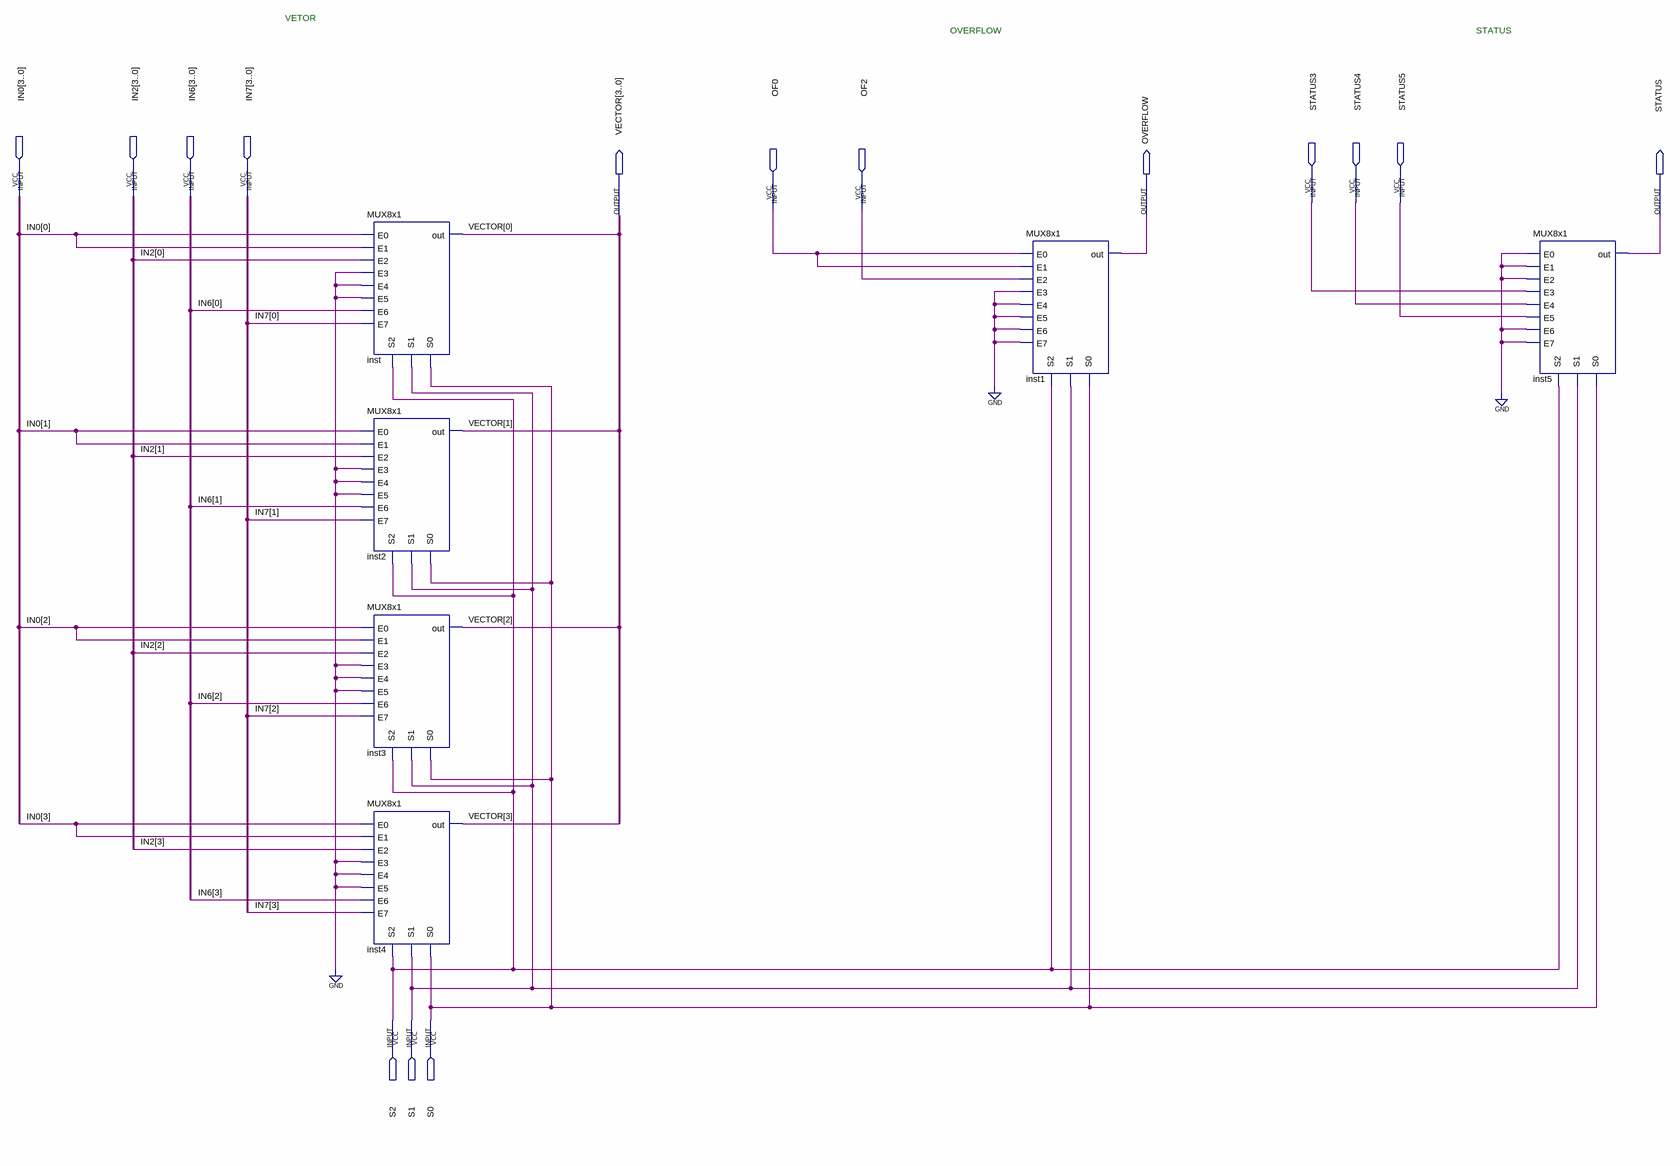
[diagram p0: schematic sheet]
// Quartus schematic MUX8x1Correct.bdf as structural Verilog: 6 symbols, 15 pins
module MUX8x1Correct (
  input  [3:0] IN0,
  input  [3:0] IN2,
  input  [3:0] IN6,
  input  [3:0] IN7,
  input  STATUS3,
  input  STATUS4,
  input  STATUS5,
  input  OF0,
  input  OF2,
  input  S2,
  input  S1,
  input  S0,
  output [3:0] VECTOR,
  output OVERFLOW,
  output STATUS
);

  MUX8x1 inst (
    .E0(IN0[0]), .E1(IN0[0]), .E2(IN2[0]), .E3(1'b0), .E4(1'b0), .E5(1'b0), .E6(IN6[0]), .E7(IN7[0]),
    .S0(S0), .S1(S1), .S2(S2), .out(VECTOR[0]));
  MUX8x1 inst2 (
    .E0(IN0[1]), .E1(IN0[1]), .E2(IN2[1]), .E3(1'b0), .E4(1'b0), .E5(1'b0), .E6(IN6[1]), .E7(IN7[1]),
    .S0(S0), .S1(S1), .S2(S2), .out(VECTOR[1]));
  MUX8x1 inst3 (
    .E0(IN0[2]), .E1(IN0[2]), .E2(IN2[2]), .E3(1'b0), .E4(1'b0), .E5(1'b0), .E6(IN6[2]), .E7(IN7[2]),
    .S0(S0), .S1(S1), .S2(S2), .out(VECTOR[2]));
  MUX8x1 inst4 (
    .E0(IN0[3]), .E1(IN0[3]), .E2(IN2[3]), .E3(1'b0), .E4(1'b0), .E5(1'b0), .E6(IN6[3]), .E7(IN7[3]),
    .S0(S0), .S1(S1), .S2(S2), .out(VECTOR[3]));
  MUX8x1 inst1 (
    .E0(OF0), .E1(OF0), .E2(OF2), .E3(1'b0), .E4(1'b0), .E5(1'b0), .E6(1'b0), .E7(1'b0), .S0(S0), .S1(S1),
    .S2(S2), .out(OVERFLOW));
  MUX8x1 inst5 (
    .E0(1'b0), .E1(1'b0), .E2(1'b0), .E3(STATUS3), .E4(STATUS4), .E5(STATUS5), .E6(1'b0), .E7(1'b0), .S0(S0),
    .S1(S1), .S2(S2), .out(STATUS));

  // Notes on the sheet:
  //   VETOR
  //   OVERFLOW
  //   STATUS
endmodule
